# EasyEDA Pro project CALU_BMS_V1.3.0.0.epro, board PCB5
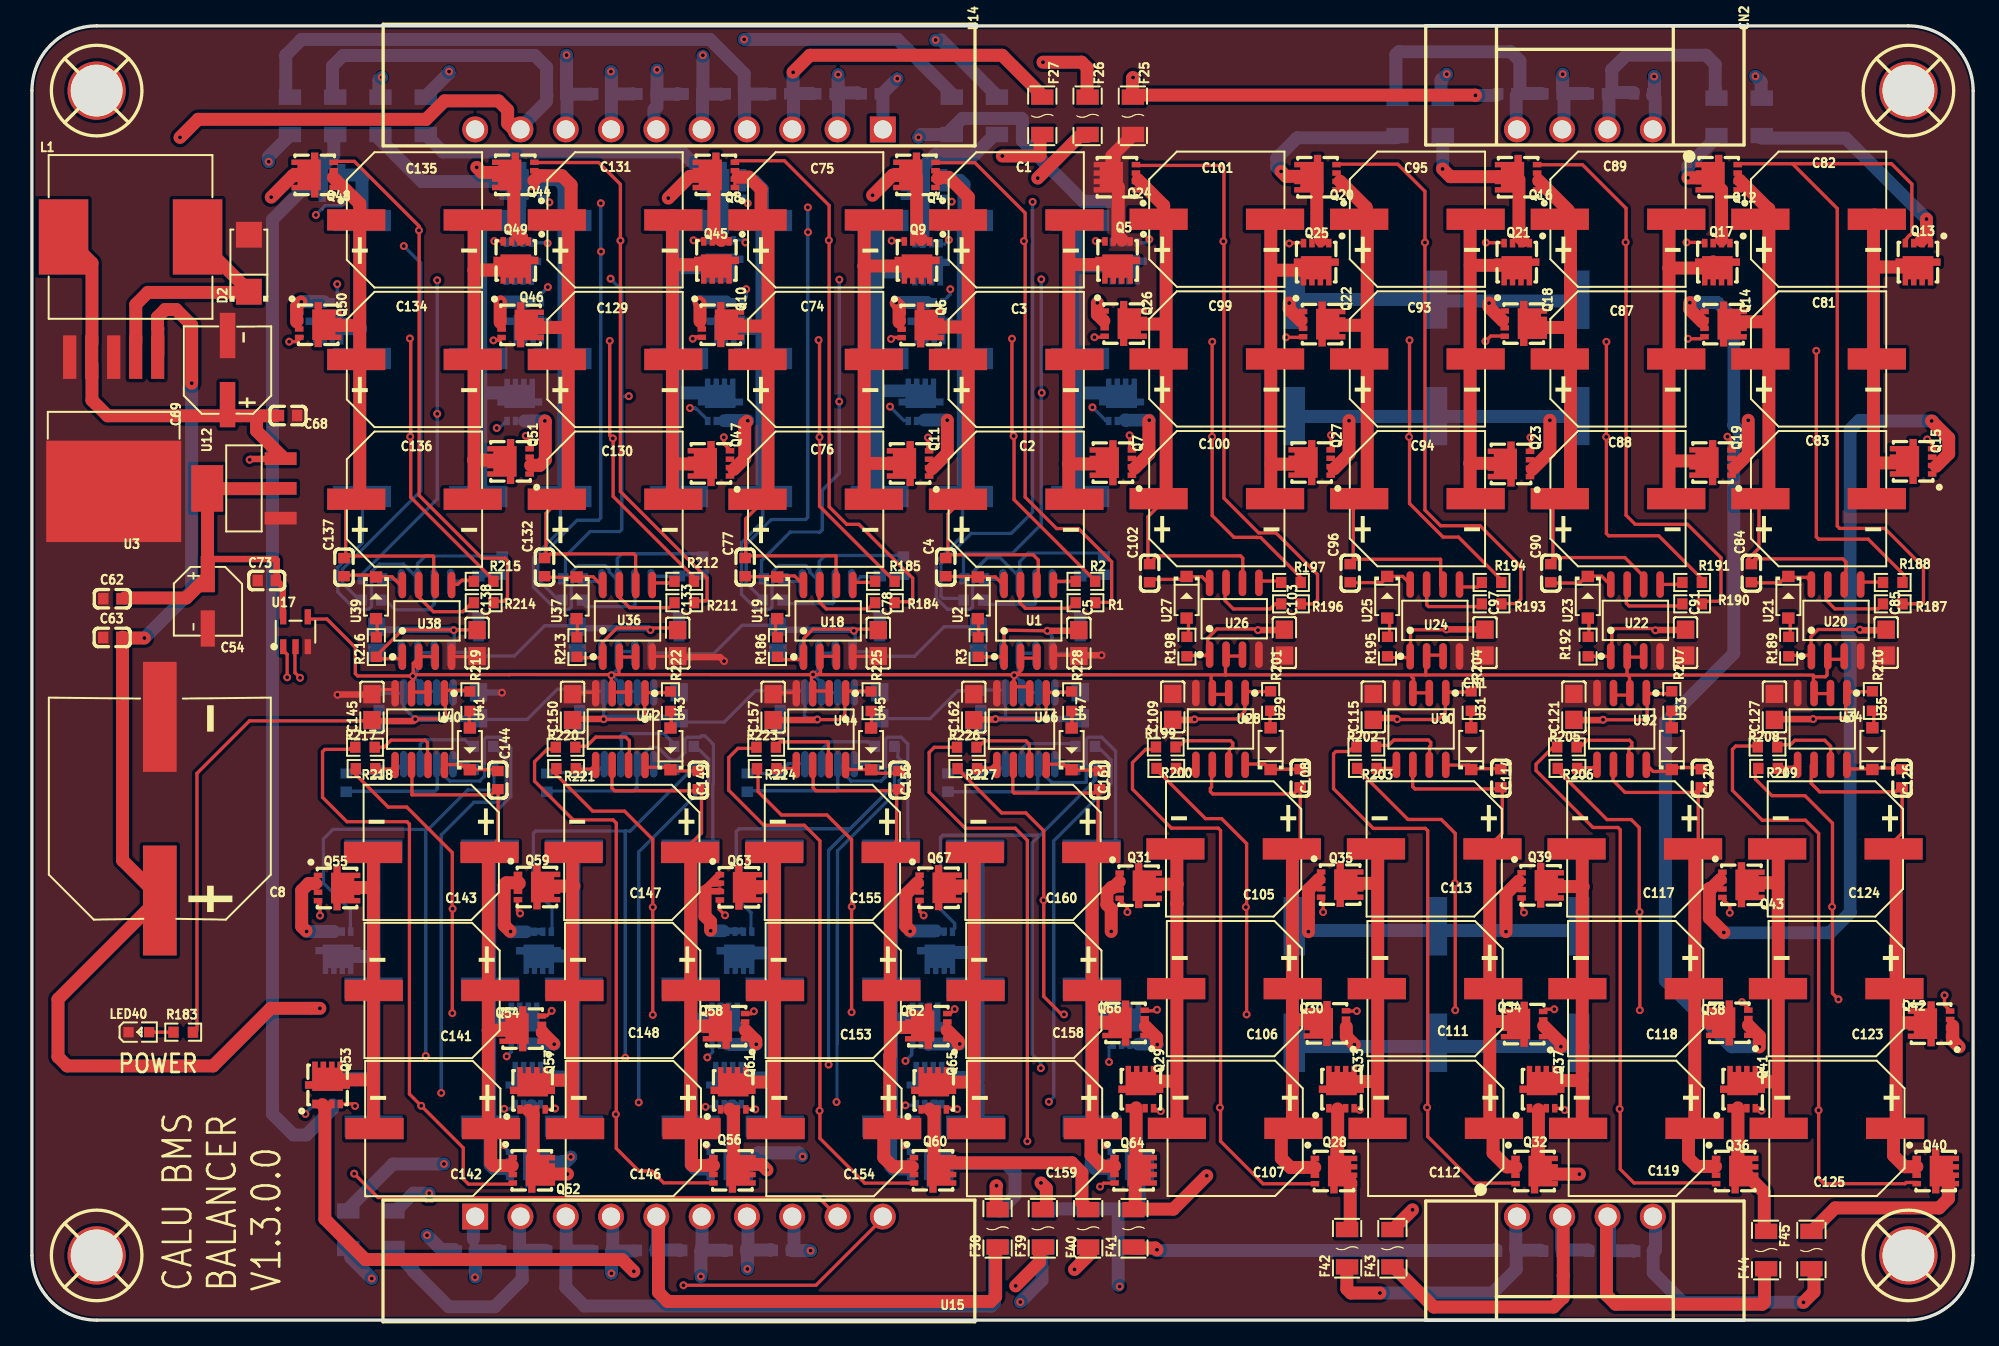
[diagram p21: board, top side]
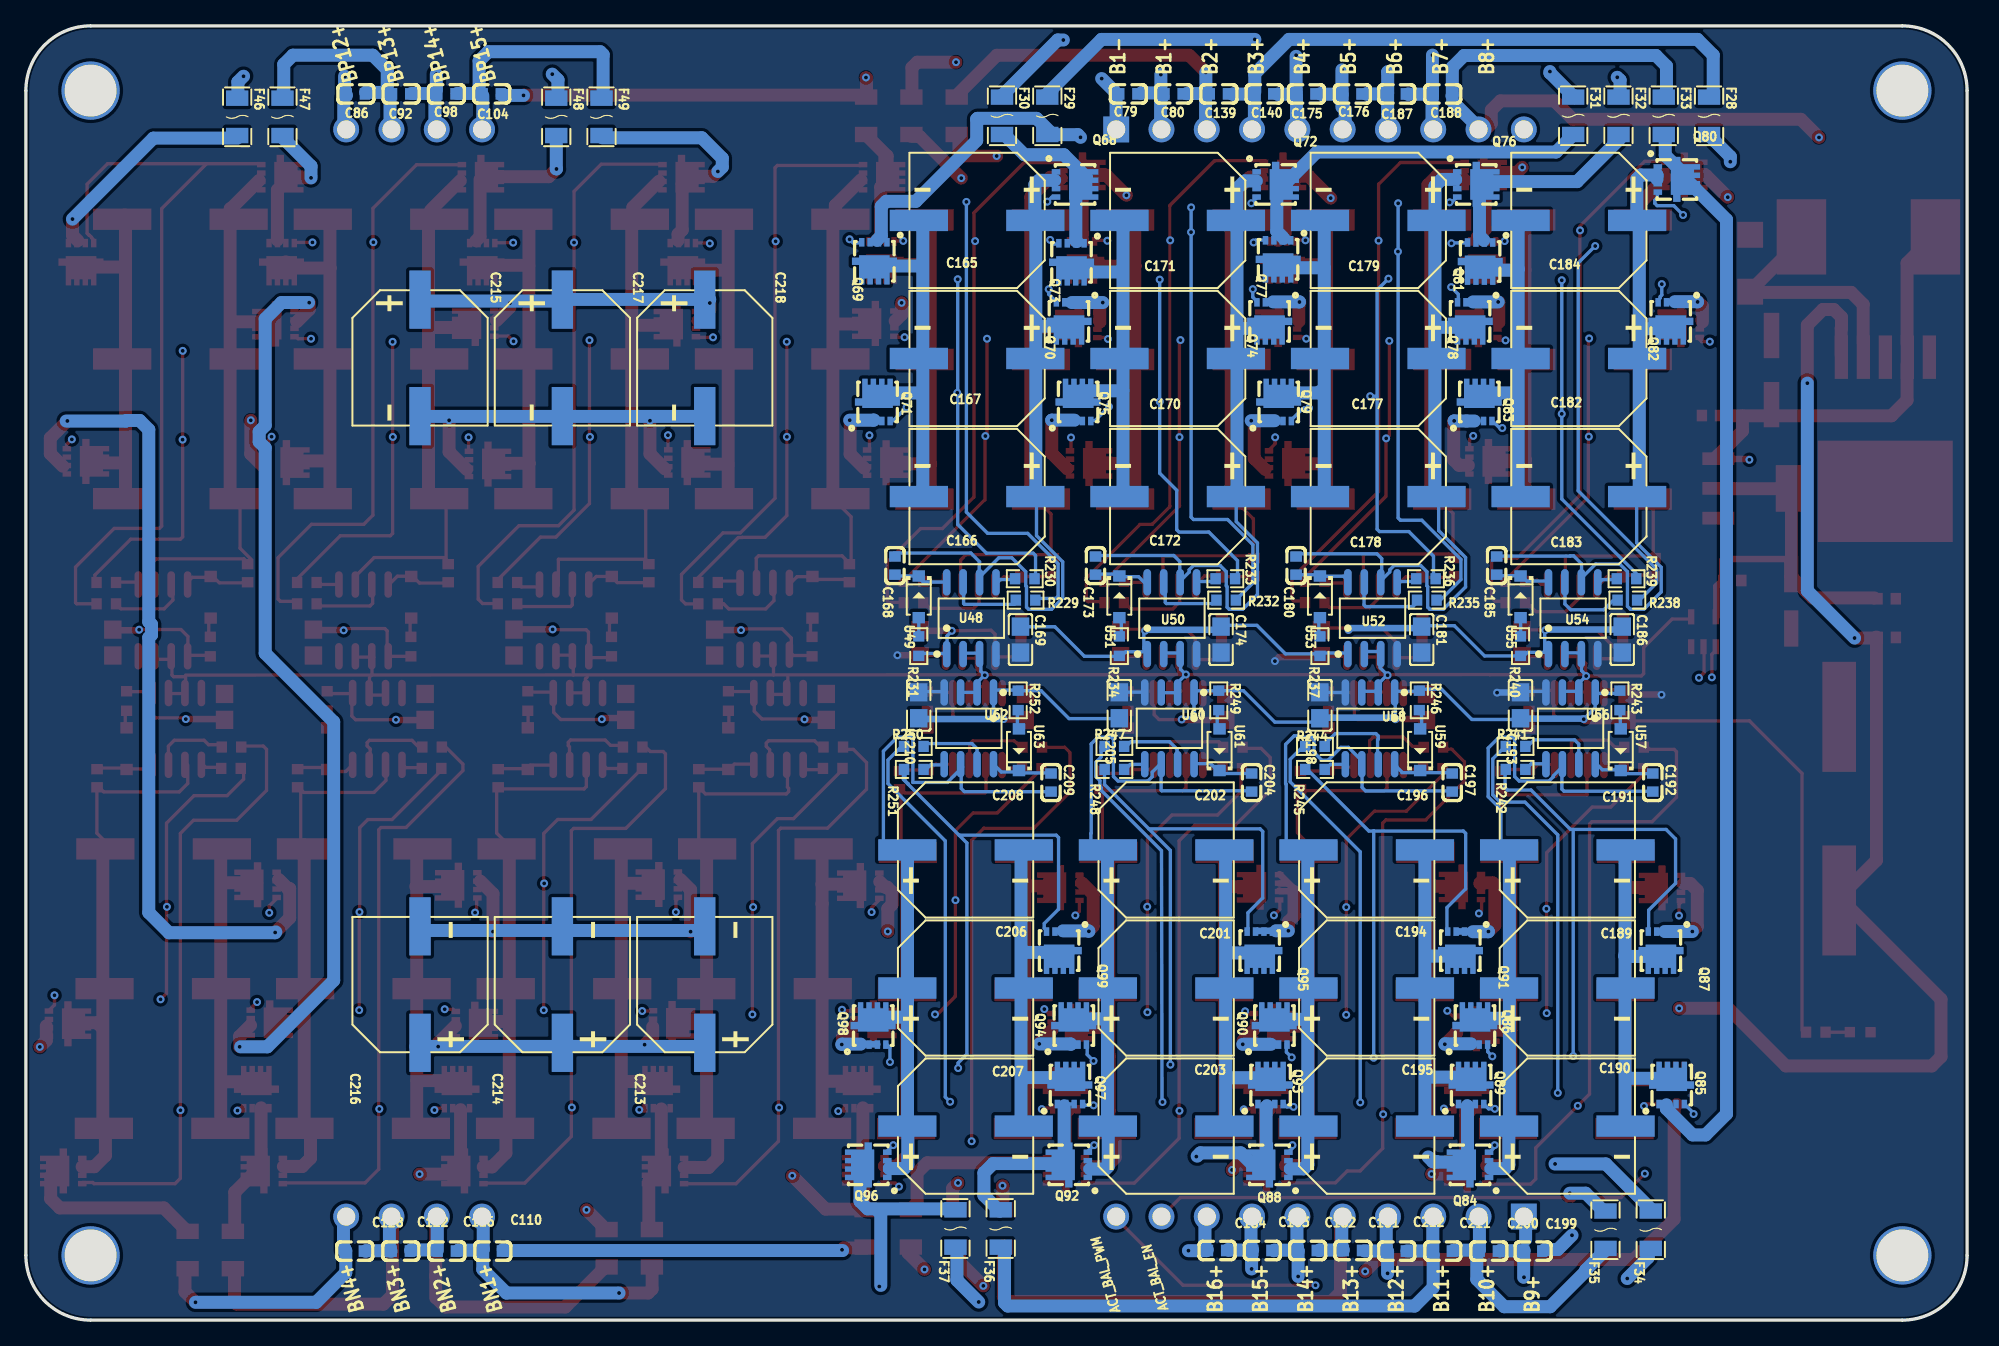
[diagram p22: board, bottom side, seen from below]

Outline 150 x 100 mm; copper layers: Top Layer, Inner1, Inner2, Bottom Layer. Coordinates in mm from the lower left corner of the outline.
Outline path: 0,95 0,5 arc(1.46,1.46) 5,0 145,0 arc(148.54,1.46) 150,5 150,95 arc(148.54,98.54) 145,100 5,100 arc(1.46,98.54) 0,95
Stack: Top Layer 0.035mm Outer layer thickness 1oz / Dielectric1 0.2104mm 7628 RC49% 8.6mil / Inner1 0.0152mm Inner layer thickness / Dielectric2 1.065mm 1.1mm H/HOZ Copper / Inner2 0.0152mm Inner layer thickness / Dielectric3 0.2104mm 7628 RC49% 8.6mil / Bottom Layer 0.035mm Outer layer thickness 1oz

## Design rules (mm)
template: Custom Config
spacing copperThickness1oz (default): track to track 0.102, other pairs 0.152 to 0.3
spacing copperThickness2oz: track to track 0.203, other pairs 0.152 to 0.3
track width copperThickness1oz (default): min 0.127, default 0.254, max 2.54
track width copperThickness2oz: min 0.203, default 0.254, max 2.54
differential pair differentialPair (default): width min 0.127, default 0.254, max 2.54; gap min 0.152, default 0.152
via viaSize (default): diameter min 0.5, default 0.61, max 10; hole min 0.3, default 0.305, max 6.3

## Placement (name value [footprint] x y rotation side)
C1  2200uF  [CAP-SMD_BD10.0-L10.3-W10.3-LS11.0-FD]  76.06 85.01 0 top
C2  2200uF  [CAP-SMD_BD10.0-L10.3-W10.3-LS11.0-FD]  76.06 63.43 0 top
C3  2200uF  [CAP-SMD_BD10.0-L10.3-W10.3-LS11.0-FD]  76.06 74.23 0 top
C4  470nF  [C0603]  70.61 58.18 90 top
C5  10uF  [C0805]  80.9 52.31 270 top
C8  470uF  [CAP-SMD_BD16.0-L17.0-W17.0-FD-LS18.0]  9.88 39.52 90 top
C54  22uF  [CAP-SMD_BD5.0-L5.3-W5.3-LS6.0-FD]  13.59 55.54 270 top
C62  100nF  [C0603]  6.21 55.74 0 top
C63  100nF  [C0603]  6.2 52.75 0 top
C68  100nF  [C0603]  19.79 69.89 180 top
C69  470uF  [CAP-SMD_BD6.3-L6.6-W6.6-LS7.6-RD]  15.11 73.41 90 top
C73  100nF  [C0603]  18.14 57.15 0 top
C74  2200uF  [CAP-SMD_BD10.0-L10.3-W10.3-LS11.0-FD]  60.56 74.23 0 top
C75  2200uF  [CAP-SMD_BD10.0-L10.3-W10.3-LS11.0-FD]  60.56 85.01 0 top
C76  2200uF  [CAP-SMD_BD10.0-L10.3-W10.3-LS11.0-FD]  60.56 63.43 0 top
C77  470nF  [C0603]  55.11 58.18 90 top
C78  10uF  [C0805]  65.4 52.31 270 top
C79  100nF  [C0603]  64.81 94.75 180 bottom
C80  100nF  [C0603]  61.31 94.75 180 bottom
C81  2200uF  [CAP-SMD_BD10.0-L10.3-W10.3-LS11.0-FD]  138.06 74.27 0 top
C82  2200uF  [CAP-SMD_BD10.0-L10.3-W10.3-LS11.0-FD]  138.06 85.06 0 top
C83  2200uF  [CAP-SMD_BD10.0-L10.3-W10.3-LS11.0-FD]  138.06 63.47 0 top
C84  470nF  [C0603]  132.87 57.71 90 top
C85  10uF  [C0805]  143.28 52.35 270 top
C86  100nF  [C0603]  124.5 94.75 180 bottom
C87  2200uF  [CAP-SMD_BD10.0-L10.3-W10.3-LS11.0-FD]  122.56 74.27 0 top
C88  2200uF  [CAP-SMD_BD10.0-L10.3-W10.3-LS11.0-FD]  122.56 63.47 0 top
C89  2200uF  [CAP-SMD_BD10.0-L10.3-W10.3-LS11.0-FD]  122.56 85.06 0 top
C90  470nF  [C0603]  117.37 57.71 90 top
C91  10uF  [C0805]  127.78 52.35 270 top
C92  100nF  [C0603]  121 94.75 180 bottom
C93  2200uF  [CAP-SMD_BD10.0-L10.3-W10.3-LS11.0-FD]  107.06 74.27 0 top
C94  2200uF  [CAP-SMD_BD10.0-L10.3-W10.3-LS11.0-FD]  107.06 63.47 0 top
C95  2200uF  [CAP-SMD_BD10.0-L10.3-W10.3-LS11.0-FD]  107.06 85.06 0 top
C96  470nF  [C0603]  101.87 57.71 90 top
C97  10uF  [C0805]  112.28 52.35 270 top
C98  100nF  [C0603]  117.5 94.75 180 bottom
C99  2200uF  [CAP-SMD_BD10.0-L10.3-W10.3-LS11.0-FD]  91.56 74.27 0 top
C100  2200uF  [CAP-SMD_BD10.0-L10.3-W10.3-LS11.0-FD]  91.56 63.47 0 top
C101  2200uF  [CAP-SMD_BD10.0-L10.3-W10.3-LS11.0-FD]  91.56 85.06 0 top
C102  470nF  [C0603]  86.37 57.71 90 top
C103  10uF  [C0805]  96.78 52.35 270 top
C104  100nF  [C0603]  114 94.75 180 bottom
C105  2200uF  [CAP-SMD_BD10.0-L10.3-W10.3-LS11.0-FD]  92.86 36.41 180 top
C106  2200uF  [CAP-SMD_BD10.0-L10.3-W10.3-LS11.0-FD]  92.92 25.61 180 top
C107  2200uF  [CAP-SMD_BD10.0-L10.3-W10.3-LS11.0-FD]  92.97 14.82 180 top
C108  470nF  [C0603]  98 41.87 270 top
C109  10uF  [C0805]  88.15 47.38 90 top
C110  100nF  [C0603]  113.92 5.33 0 bottom
C111  2200uF  [CAP-SMD_BD10.0-L10.3-W10.3-LS11.0-FD]  108.42 25.61 180 top
C112  2200uF  [CAP-SMD_BD10.0-L10.3-W10.3-LS11.0-FD]  108.47 14.82 180 top
C113  2200uF  [CAP-SMD_BD10.0-L10.3-W10.3-LS11.0-FD]  108.36 36.41 180 top
C114  470nF  [C0603]  113.5 41.87 270 top
C115  10uF  [C0805]  103.65 47.38 90 top
C116  100nF  [C0603]  117.47 5.33 0 bottom
C117  2200uF  [CAP-SMD_BD10.0-L10.3-W10.3-LS11.0-FD]  123.86 36.41 180 top
C118  2200uF  [CAP-SMD_BD10.0-L10.3-W10.3-LS11.0-FD]  123.92 25.61 180 top
C119  2200uF  [CAP-SMD_BD10.0-L10.3-W10.3-LS11.0-FD]  123.97 14.82 180 top
C120  470nF  [C0603]  129 41.87 270 top
C121  10uF  [C0805]  119.15 47.38 90 top
C122  100nF  [C0603]  121.03 5.33 0 bottom
C123  2200uF  [CAP-SMD_BD10.0-L10.3-W10.3-LS11.0-FD]  139.42 25.61 180 top
C124  2200uF  [CAP-SMD_BD10.0-L10.3-W10.3-LS11.0-FD]  139.36 36.41 180 top
C125  2200uF  [CAP-SMD_BD10.0-L10.3-W10.3-LS11.0-FD]  139.47 14.82 180 top
C126  470nF  [C0603]  144.5 41.87 270 top
C127  10uF  [C0805]  134.65 47.38 90 top
C128  100nF  [C0603]  124.59 5.33 0 bottom
C129  2200uF  [CAP-SMD_BD10.0-L10.3-W10.3-LS11.0-FD]  45.06 74.23 0 top
C130  2200uF  [CAP-SMD_BD10.0-L10.3-W10.3-LS11.0-FD]  45.06 63.43 0 top
C131  2200uF  [CAP-SMD_BD10.0-L10.3-W10.3-LS11.0-FD]  45.06 85.01 0 top
C132  470nF  [C0603]  39.61 58.18 90 top
C133  10uF  [C0805]  49.9 52.31 270 top
C134  2200uF  [CAP-SMD_BD10.0-L10.3-W10.3-LS11.0-FD]  29.56 74.23 0 top
C135  2200uF  [CAP-SMD_BD10.0-L10.3-W10.3-LS11.0-FD]  29.56 85.01 0 top
C136  2200uF  [CAP-SMD_BD10.0-L10.3-W10.3-LS11.0-FD]  29.56 63.43 0 top
C137  470nF  [C0603]  24.11 58.18 90 top
C138  10uF  [C0805]  34.4 52.31 270 top
C139  100nF  [C0603]  57.81 94.75 180 bottom
C140  100nF  [C0603]  54.31 94.75 180 bottom
C141  2200uF  [CAP-SMD_BD10.0-L10.3-W10.3-LS11.0-FD]  30.92 25.47 180 top
C142  2200uF  [CAP-SMD_BD10.0-L10.3-W10.3-LS11.0-FD]  30.97 14.8 180 top
C143  2200uF  [CAP-SMD_BD10.0-L10.3-W10.3-LS11.0-FD]  30.86 36.14 180 top
C144  470nF  [C0603]  36 41.72 270 top
C145  10uF  [C0805]  26.27 47.36 90 top
C146  2200uF  [CAP-SMD_BD10.0-L10.3-W10.3-LS11.0-FD]  46.47 14.8 180 top
C147  2200uF  [CAP-SMD_BD10.0-L10.3-W10.3-LS11.0-FD]  46.36 36.14 180 top
C148  2200uF  [CAP-SMD_BD10.0-L10.3-W10.3-LS11.0-FD]  46.42 25.47 180 top
C149  470nF  [C0603]  51.5 41.72 270 top
C150  10uF  [C0805]  41.77 47.36 90 top
C151  100nF  [C0603]  47.45 5.38 0 bottom
C152  100nF  [C0603]  50.95 5.38 0 bottom
C153  2200uF  [CAP-SMD_BD10.0-L10.3-W10.3-LS11.0-FD]  61.92 25.47 180 top
C154  2200uF  [CAP-SMD_BD10.0-L10.3-W10.3-LS11.0-FD]  61.97 14.8 180 top
C155  2200uF  [CAP-SMD_BD10.0-L10.3-W10.3-LS11.0-FD]  61.86 36.14 180 top
C156  470nF  [C0603]  67 41.72 270 top
C157  10uF  [C0805]  57.27 47.36 90 top
C158  2200uF  [CAP-SMD_BD10.0-L10.3-W10.3-LS11.0-FD]  77.42 25.47 180 top
C159  2200uF  [CAP-SMD_BD10.0-L10.3-W10.3-LS11.0-FD]  77.47 14.8 180 top
C160  2200uF  [CAP-SMD_BD10.0-L10.3-W10.3-LS11.0-FD]  77.36 36.14 180 top
C161  470nF  [C0603]  82.5 41.72 270 top
C162  10uF  [C0805]  72.77 47.36 90 top
C163  100nF  [C0603]  54.45 5.38 0 bottom
C164  100nF  [C0603]  57.95 5.38 0 bottom
C165  2200uF  [CAP-SMD_BD10.0-L10.3-W10.3-LS11.0-FD]  76.5 84.97 0 bottom
C166  2200uF  [CAP-SMD_BD10.0-L10.3-W10.3-LS11.0-FD]  76.5 63.63 0 bottom
C167  2200uF  [CAP-SMD_BD10.0-L10.3-W10.3-LS11.0-FD]  76.5 74.3 0 bottom
C168  470nF  [C0603]  82.85 58.3 90 bottom
C169  10uF  [C0805]  73.15 52.58 270 bottom
C170  2200uF  [CAP-SMD_BD10.0-L10.3-W10.3-LS11.0-FD]  61 74.3 0 bottom
C171  2200uF  [CAP-SMD_BD10.0-L10.3-W10.3-LS11.0-FD]  61 84.97 0 bottom
C172  2200uF  [CAP-SMD_BD10.0-L10.3-W10.3-LS11.0-FD]  61 63.63 0 bottom
C173  470nF  [C0603]  67.35 58.3 90 bottom
C174  10uF  [C0805]  57.64 52.58 270 bottom
C175  100nF  [C0603]  51.05 94.74 180 bottom
C176  100nF  [C0603]  47.5 94.74 180 bottom
C177  2200uF  [CAP-SMD_BD10.0-L10.3-W10.3-LS11.0-FD]  45.5 74.3 0 bottom
C178  2200uF  [CAP-SMD_BD10.0-L10.3-W10.3-LS11.0-FD]  45.5 63.63 0 bottom
C179  2200uF  [CAP-SMD_BD10.0-L10.3-W10.3-LS11.0-FD]  45.5 84.97 0 bottom
C180  470nF  [C0603]  51.85 58.3 90 bottom
C181  10uF  [C0805]  42.14 52.58 270 bottom
C182  2200uF  [CAP-SMD_BD10.0-L10.3-W10.3-LS11.0-FD]  30 74.3 0 bottom
C183  2200uF  [CAP-SMD_BD10.0-L10.3-W10.3-LS11.0-FD]  30 63.63 0 bottom
C184  2200uF  [CAP-SMD_BD10.0-L10.3-W10.3-LS11.0-FD]  30 84.97 0 bottom
C185  470nF  [C0603]  36.35 58.3 90 bottom
C186  10uF  [C0805]  26.64 52.58 270 bottom
C187  100nF  [C0603]  44.07 94.74 180 bottom
C188  100nF  [C0603]  40.51 94.74 180 bottom
C189  2200uF  [CAP-SMD_BD10.0-L10.3-W10.3-LS11.0-FD]  30.89 25.66 180 bottom
C190  2200uF  [CAP-SMD_BD10.0-L10.3-W10.3-LS11.0-FD]  30.89 14.99 180 bottom
C191  2200uF  [CAP-SMD_BD10.0-L10.3-W10.3-LS11.0-FD]  30.89 36.33 180 bottom
C192  470nF  [C0603]  24.28 41.53 270 bottom
C193  10uF  [C0805]  34.51 47.5 90 bottom
C194  2200uF  [CAP-SMD_BD10.0-L10.3-W10.3-LS11.0-FD]  46.39 25.66 180 bottom
C195  2200uF  [CAP-SMD_BD10.0-L10.3-W10.3-LS11.0-FD]  46.39 14.99 180 bottom
C196  2200uF  [CAP-SMD_BD10.0-L10.3-W10.3-LS11.0-FD]  46.39 36.33 180 bottom
C197  470nF  [C0603]  39.78 41.53 270 bottom
C198  10uF  [C0805]  50.01 47.5 90 bottom
C199  100nF  [C0603]  33.53 5.33 0 bottom
C200  100nF  [C0603]  36.96 5.33 0 bottom
C201  2200uF  [CAP-SMD_BD10.0-L10.3-W10.3-LS11.0-FD]  61.89 25.66 180 bottom
C202  2200uF  [CAP-SMD_BD10.0-L10.3-W10.3-LS11.0-FD]  61.89 36.33 180 bottom
C203  2200uF  [CAP-SMD_BD10.0-L10.3-W10.3-LS11.0-FD]  61.89 14.99 180 bottom
C204  470nF  [C0603]  55.28 41.53 270 bottom
C205  10uF  [C0805]  65.51 47.5 90 bottom
C206  2200uF  [CAP-SMD_BD10.0-L10.3-W10.3-LS11.0-FD]  77.39 25.66 180 bottom
C207  2200uF  [CAP-SMD_BD10.0-L10.3-W10.3-LS11.0-FD]  77.39 14.99 180 bottom
C208  2200uF  [CAP-SMD_BD10.0-L10.3-W10.3-LS11.0-FD]  77.39 36.33 180 bottom
C209  470nF  [C0603]  70.78 41.53 270 bottom
C210  10uF  [C0805]  81.01 47.5 90 bottom
C211  100nF  [C0603]  40.51 5.33 0 bottom
C212  100nF  [C0603]  44.07 5.33 0 bottom
C213  2200uF  [CAP-SMD_BD10.0-L10.3-W10.3-LS11.0-FD]  97.54 25.93 90 bottom
C214  2200uF  [CAP-SMD_BD10.0-L10.3-W10.3-LS11.0-FD]  108.54 25.93 90 bottom
C215  2200uF  [CAP-SMD_BD10.0-L10.3-W10.3-LS11.0-FD]  119.54 74.35 270 bottom
C216  2200uF  [CAP-SMD_BD10.0-L10.3-W10.3-LS11.0-FD]  119.54 25.93 90 bottom
C217  2200uF  [CAP-SMD_BD10.0-L10.3-W10.3-LS11.0-FD]  108.54 74.35 270 bottom
C218  2200uF  [CAP-SMD_BD10.0-L10.3-W10.3-LS11.0-FD]  97.54 74.35 270 bottom
CN1  BATT_NEXT  [CONN-TH_4P-P3.50_MAX_MX15EDGRM-3.5-04P-GN01-CU-A]  120 8 0 top
CN2  BATT_PREV  [CONN-TH_4P-P3.50_MAX_MX15EDGRM-3.5-04P-GN01-CU-A]  120 92 180 top
D2  SS34  [SMA_L4.3-W2.6-LS5.2-RD]  16.76 81.66 90 top
F25  SMD1206P005TF  [F1206]  85.07 93.05 270 top
F26  SMD1206P005TF  [F1206]  81.57 93.05 270 top
F27  SMD1206P005TF  [F1206]  78.07 93.05 270 top
F28  SMD1206P005TF  [F1206]  19.94 93.05 270 bottom
F29  SMD1206P005TF  [F1206]  71.07 93.05 270 bottom
F30  SMD1206P005TF  [F1206]  74.57 93.05 270 bottom
F31  SMD1206P005TF  [F1206]  30.44 93.05 270 bottom
F32  SMD1206P005TF  [F1206]  26.94 93.05 270 bottom
F33  SMD1206P005TF  [F1206]  23.44 93.05 270 bottom
F34  SMD1206P005TF  [F1206]  24.44 6.99 90 bottom
F35  SMD1206P005TF  [F1206]  27.94 6.99 90 bottom
F36  SMD1206P005TF  [F1206]  74.67 7.08 90 bottom
F37  SMD1206P005TF  [F1206]  78.17 7.08 90 bottom
F38  SMD1206P005TF  [F1206]  74.62 7.09 90 top
F39  SMD1206P005TF  [F1206]  78.12 7.09 90 top
F40  SMD1206P005TF  [F1206]  81.62 7.09 90 top
F41  SMD1206P005TF  [F1206]  85.12 7.09 90 top
F42  SMD1206P005TF  [F1206]  101.63 5.55 90 top
F43  SMD1206P005TF  [F1206]  105.13 5.55 90 top
F44  SMD1206P005TF  [F1206]  134 5.41 90 top
F45  SMD1206P005TF  [F1206]  137.5 5.41 90 top
F46  SMD1206P005TF  [F1206]  133.67 92.97 270 bottom
F47  SMD1206P005TF  [F1206]  130.17 92.97 270 bottom
F48  SMD1206P005TF  [F1206]  109.02 92.97 270 bottom
F49  SMD1206P005TF  [F1206]  105.52 92.97 270 bottom
L1  68uH  [IND-SMD_L12.5-W12.5]  7.62 83.69 0 top
LED40  LED_PWR  [LED0603-RD-YELLOW]  8.26 22.25 0 top
Q4  40N06D  [WDFN-5_L3.1-W3.1-P0.65-BL_1]  69.08 88.49 90 top
Q5  40N06D  [WDFN-5_L3.1-W3.1-P0.65-BL_1]  83.89 82.61 180 top
Q6  40N06D  [WDFN-5_L3.1-W3.1-P0.65-BL_1]  67.94 76.89 270 top
Q7  40N06D  [WDFN-5_L3.1-W3.1-P0.65-BL_1]  84.26 66.25 90 top
Q8  40N06D  [WDFN-5_L3.1-W3.1-P0.65-BL_1]  53.58 88.49 90 top
Q9  40N06D  [WDFN-5_L3.1-W3.1-P0.65-BL_1]  68.39 82.61 180 top
Q10  40N06D  [WDFN-5_L3.1-W3.1-P0.65-BL_1]  52.5 76.91 270 top
Q11  40N06D  [WDFN-5_L3.1-W3.1-P0.65-BL_1]  68.59 66.19 90 top
Q12  40N06D  [WDFN-5_L3.1-W3.1-P0.65-BL_1]  131.08 88.3 90 top
Q13  40N06D  [WDFN-5_L3.1-W3.1-P0.65-BL_1]  145.74 82.48 180 top
Q14  40N06D  [WDFN-5_L3.1-W3.1-P0.65-BL_1]  129.98 76.95 270 top
Q15  40N06D  [WDFN-5_L3.1-W3.1-P0.65-BL_1]  146.1 66.36 90 top
Q16  40N06D  [WDFN-5_L3.1-W3.1-P0.65-BL_1]  115.58 88.3 90 top
Q17  40N06D  [WDFN-5_L3.1-W3.1-P0.65-BL_1]  130.24 82.48 180 top
Q18  40N06D  [WDFN-5_L3.1-W3.1-P0.65-BL_1]  114.54 77 270 top
Q19  40N06D  [WDFN-5_L3.1-W3.1-P0.65-BL_1]  130.6 66.26 90 top
Q20  40N06D  [WDFN-5_L3.1-W3.1-P0.65-BL_1]  100.08 88.3 90 top
Q21  40N06D  [WDFN-5_L3.1-W3.1-P0.65-BL_1]  114.74 82.48 180 top
Q22  40N06D  [WDFN-5_L3.1-W3.1-P0.65-BL_1]  98.96 76.95 270 top
Q23  40N06D  [WDFN-5_L3.1-W3.1-P0.65-BL_1]  115.03 66.15 90 top
Q24  40N06D  [WDFN-5_L3.1-W3.1-P0.65-BL_1]  84.58 88.3 90 top
Q25  40N06D  [WDFN-5_L3.1-W3.1-P0.65-BL_1]  99.24 82.48 180 top
Q26  40N06D  [WDFN-5_L3.1-W3.1-P0.65-BL_1]  83.62 77 270 top
Q27  40N06D  [WDFN-5_L3.1-W3.1-P0.65-BL_1]  99.62 66.27 90 top
Q28  40N06D  [WDFN-5_L3.1-W3.1-P0.65-BL_1]  99.88 11.52 270 top
Q29  40N06D  [WDFN-5_L3.1-W3.1-P0.65-BL_1]  85.69 17.11 0 top
Q30  40N06D  [WDFN-5_L3.1-W3.1-P0.65-BL_1]  100.81 22.93 90 top
Q31  40N06D  [WDFN-5_L3.1-W3.1-P0.65-BL_1]  84.79 33.56 270 top
Q32  40N06D  [WDFN-5_L3.1-W3.1-P0.65-BL_1]  115.38 11.52 270 top
Q33  40N06D  [WDFN-5_L3.1-W3.1-P0.65-BL_1]  101.19 17.11 0 top
Q34  40N06D  [WDFN-5_L3.1-W3.1-P0.65-BL_1]  116.04 22.87 90 top
Q35  40N06D  [WDFN-5_L3.1-W3.1-P0.65-BL_1]  100.36 33.65 270 top
Q36  40N06D  [WDFN-5_L3.1-W3.1-P0.65-BL_1]  130.88 11.52 270 top
Q37  40N06D  [WDFN-5_L3.1-W3.1-P0.65-BL_1]  116.69 17.11 0 top
Q38  40N06D  [WDFN-5_L3.1-W3.1-P0.65-BL_1]  131.89 22.98 90 top
Q39  40N06D  [WDFN-5_L3.1-W3.1-P0.65-BL_1]  115.85 33.59 270 top
Q40  40N06D  [WDFN-5_L3.1-W3.1-P0.65-BL_1]  146.38 11.52 270 top
Q41  40N06D  [WDFN-5_L3.1-W3.1-P0.65-BL_1]  132.19 17.11 0 top
Q42  40N06D  [WDFN-5_L3.1-W3.1-P0.65-BL_1]  147.49 22.91 90 top
Q43  40N06D  [WDFN-5_L3.1-W3.1-P0.65-BL_1]  131.36 33.63 270 top
Q44  40N06D  [WDFN-5_L3.1-W3.1-P0.65-BL_1]  38.08 88.49 90 top
Q45  40N06D  [WDFN-5_L3.1-W3.1-P0.65-BL_1]  52.89 82.61 180 top
Q46  40N06D  [WDFN-5_L3.1-W3.1-P0.65-BL_1]  37.03 76.9 270 top
Q47  40N06D  [WDFN-5_L3.1-W3.1-P0.65-BL_1]  53.21 66.2 90 top
Q48  40N06D  [WDFN-5_L3.1-W3.1-P0.65-BL_1]  22.58 88.49 90 top
Q49  40N06D  [WDFN-5_L3.1-W3.1-P0.65-BL_1]  37.39 82.61 180 top
Q50  40N06D  [WDFN-5_L3.1-W3.1-P0.65-BL_1]  21.39 76.91 270 top
Q51  40N06D  [WDFN-5_L3.1-W3.1-P0.65-BL_1]  37.72 66.35 90 top
Q52  40N06D  [WDFN-5_L3.1-W3.1-P0.65-BL_1]  37.89 11.57 270 top
Q53  40N06D  [WDFN-5_L3.1-W3.1-P0.65-BL_1]  22.85 17.44 0 top
Q54  40N06D  [WDFN-5_L3.1-W3.1-P0.65-BL_1]  38.65 22.52 90 top
Q55  40N06D  [WDFN-5_L3.1-W3.1-P0.65-BL_1]  22.84 33.39 270 top
Q56  40N06D  [WDFN-5_L3.1-W3.1-P0.65-BL_1]  53.39 11.57 270 top
Q57  40N06D  [WDFN-5_L3.1-W3.1-P0.65-BL_1]  38.69 17.02 0 top
Q58  40N06D  [WDFN-5_L3.1-W3.1-P0.65-BL_1]  54.37 22.71 90 top
Q59  40N06D  [WDFN-5_L3.1-W3.1-P0.65-BL_1]  38.29 33.46 270 top
Q60  40N06D  [WDFN-5_L3.1-W3.1-P0.65-BL_1]  68.89 11.57 270 top
Q61  40N06D  [WDFN-5_L3.1-W3.1-P0.65-BL_1]  54.19 17.02 0 top
Q62  40N06D  [WDFN-5_L3.1-W3.1-P0.65-BL_1]  70 22.71 90 top
Q63  40N06D  [WDFN-5_L3.1-W3.1-P0.65-BL_1]  53.89 33.44 270 top
Q64  40N06D  [WDFN-5_L3.1-W3.1-P0.65-BL_1]  84.39 11.57 270 top
Q65  40N06D  [WDFN-5_L3.1-W3.1-P0.65-BL_1]  69.69 17.02 0 top
Q66  40N06D  [WDFN-5_L3.1-W3.1-P0.65-BL_1]  85.24 22.97 90 top
Q67  40N06D  [WDFN-5_L3.1-W3.1-P0.65-BL_1]  69.32 33.4 270 top
Q68  40N06D  [WDFN-5_L3.1-W3.1-P0.65-BL_1]  69.66 87.75 270 bottom
Q69  40N06D  [WDFN-5_L3.1-W3.1-P0.65-BL_1]  84.44 82.55 0 bottom
Q70  40N06D  [WDFN-5_L3.1-W3.1-P0.65-BL_1]  69.4 77.9 0 bottom
Q71  40N06D  [WDFN-5_L3.1-W3.1-P0.65-BL_1]  84.19 70.21 180 bottom
Q72  40N06D  [WDFN-5_L3.1-W3.1-P0.65-BL_1]  54.16 87.75 270 bottom
Q73  40N06D  [WDFN-5_L3.1-W3.1-P0.65-BL_1]  69.2 82.47 0 bottom
Q74  40N06D  [WDFN-5_L3.1-W3.1-P0.65-BL_1]  53.9 77.9 0 bottom
Q75  40N06D  [WDFN-5_L3.1-W3.1-P0.65-BL_1]  68.69 70.21 180 bottom
Q76  40N06D  [WDFN-5_L3.1-W3.1-P0.65-BL_1]  38.66 87.75 270 bottom
Q77  40N06D  [WDFN-5_L3.1-W3.1-P0.65-BL_1]  53.24 82.7 0 bottom
Q78  40N06D  [WDFN-5_L3.1-W3.1-P0.65-BL_1]  38.4 77.9 0 bottom
Q79  40N06D  [WDFN-5_L3.1-W3.1-P0.65-BL_1]  53.19 70.21 180 bottom
Q80  40N06D  [WDFN-5_L3.1-W3.1-P0.65-BL_1]  23.16 88.13 270 bottom
Q81  40N06D  [WDFN-5_L3.1-W3.1-P0.65-BL_1]  37.63 82.53 0 bottom
Q82  40N06D  [WDFN-5_L3.1-W3.1-P0.65-BL_1]  22.9 77.9 0 bottom
Q83  40N06D  [WDFN-5_L3.1-W3.1-P0.65-BL_1]  37.69 70.21 180 bottom
Q84  40N06D  [WDFN-5_L3.1-W3.1-P0.65-BL_1]  37.67 12 90 bottom
Q85  40N06D  [WDFN-5_L3.1-W3.1-P0.65-BL_1]  22.82 17.43 180 bottom
Q86  40N06D  [WDFN-5_L3.1-W3.1-P0.65-BL_1]  38.02 22.02 180 bottom
Q87  40N06D  [WDFN-5_L3.1-W3.1-P0.65-BL_1]  23.66 29.28 0 bottom
Q88  40N06D  [WDFN-5_L3.1-W3.1-P0.65-BL_1]  53.17 12 90 bottom
Q89  40N06D  [WDFN-5_L3.1-W3.1-P0.65-BL_1]  38.32 17.43 180 bottom
Q90  40N06D  [WDFN-5_L3.1-W3.1-P0.65-BL_1]  53.52 22.02 180 bottom
Q91  40N06D  [WDFN-5_L3.1-W3.1-P0.65-BL_1]  39.16 29.28 0 bottom
Q92  40N06D  [WDFN-5_L3.1-W3.1-P0.65-BL_1]  68.67 12 90 bottom
Q93  40N06D  [WDFN-5_L3.1-W3.1-P0.65-BL_1]  53.82 17.43 180 bottom
Q94  40N06D  [WDFN-5_L3.1-W3.1-P0.65-BL_1]  69.02 22.02 180 bottom
Q95  40N06D  [WDFN-5_L3.1-W3.1-P0.65-BL_1]  54.66 29.28 0 bottom
Q96  40N06D  [WDFN-5_L3.1-W3.1-P0.65-BL_1]  84.17 12 90 bottom
Q97  40N06D  [WDFN-5_L3.1-W3.1-P0.65-BL_1]  69.32 17.43 180 bottom
Q98  40N06D  [WDFN-5_L3.1-W3.1-P0.65-BL_1]  84.52 22.02 180 bottom
Q99  40N06D  [WDFN-5_L3.1-W3.1-P0.65-BL_1]  70.16 29.28 0 bottom
R1  4.7Ω  [R0603]  81.41 55.43 0 top
R2  4.7Ω  [R0603]  81.41 57.08 0 top
R3  4.7Ω  [R0603]  73.11 52 90 top
R183  4.7kΩ  [R0603]  11.69 22.25 0 top
R184  4.7Ω  [R0603]  65.91 55.43 0 top
R185  4.7Ω  [R0603]  65.91 57.08 0 top
R186  4.7Ω  [R0603]  57.61 52 90 top
R187  4.7Ω  [R0603]  143.79 55.34 0 top
R188  4.7Ω  [R0603]  143.79 56.99 0 top
R189  4.7Ω  [R0603]  135.75 52.04 90 top
R190  4.7Ω  [R0603]  128.29 55.34 0 top
R191  4.7Ω  [R0603]  128.29 56.99 0 top
R192  4.7Ω  [R0603]  120.25 52.04 90 top
R193  4.7Ω  [R0603]  112.79 55.34 0 top
R194  4.7Ω  [R0603]  112.79 56.99 0 top
R195  4.7Ω  [R0603]  104.75 52.04 90 top
R196  4.7Ω  [R0603]  97.29 55.34 0 top
R197  4.7Ω  [R0603]  97.29 56.99 0 top
R198  4.7Ω  [R0603]  89.25 52.04 90 top
R199  4.7Ω  [R0603]  87.61 44.28 180 top
R200  4.7Ω  [R0603]  87.65 42.63 180 top
R201  4.7Ω  [R0603]  95.72 47.84 270 top
R202  4.7Ω  [R0603]  103.11 44.28 180 top
R203  4.7Ω  [R0603]  103.15 42.63 180 top
R204  4.7Ω  [R0603]  111.22 47.84 270 top
R205  4.7Ω  [R0603]  118.61 44.28 180 top
R206  4.7Ω  [R0603]  118.65 42.63 180 top
R207  4.7Ω  [R0603]  126.72 47.84 270 top
R208  4.7Ω  [R0603]  134.11 44.28 180 top
R209  4.7Ω  [R0603]  134.15 42.63 180 top
R210  4.7Ω  [R0603]  142.22 47.84 270 top
R211  4.7Ω  [R0603]  50.41 55.43 0 top
R212  4.7Ω  [R0603]  50.41 57.08 0 top
R213  4.7Ω  [R0603]  42.11 52 90 top
R214  4.7Ω  [R0603]  34.91 55.43 0 top
R215  4.7Ω  [R0603]  34.91 57.08 0 top
R216  4.7Ω  [R0603]  26.61 52 90 top
R217  4.7Ω  [R0603]  25.74 44.27 180 top
R218  4.7Ω  [R0603]  25.78 42.61 180 top
R219  4.7Ω  [R0603]  33.84 47.82 270 top
R220  4.7Ω  [R0603]  41.24 44.27 180 top
R221  4.7Ω  [R0603]  41.28 42.61 180 top
R222  4.7Ω  [R0603]  49.34 47.82 270 top
R223  4.7Ω  [R0603]  56.74 44.27 180 top
R224  4.7Ω  [R0603]  56.78 42.61 180 top
R225  4.7Ω  [R0603]  64.84 47.82 270 top
R226  4.7Ω  [R0603]  72.24 44.27 180 top
R227  4.7Ω  [R0603]  72.28 42.61 180 top
R228  4.7Ω  [R0603]  80.34 47.82 270 top
R229  4.7Ω  [R0603]  72.75 55.63 180 bottom
R230  4.7Ω  [R0603]  72.81 57.28 180 bottom
R231  4.7Ω  [R0603]  81.01 52.08 90 bottom
R232  4.7Ω  [R0603]  57.25 55.63 180 bottom
R233  4.7Ω  [R0603]  57.31 57.28 180 bottom
R234  4.7Ω  [R0603]  65.51 52.08 90 bottom
R235  4.7Ω  [R0603]  41.75 55.63 180 bottom
R236  4.7Ω  [R0603]  41.81 57.28 180 bottom
R237  4.7Ω  [R0603]  50.01 52.08 90 bottom
R238  4.7Ω  [R0603]  26.25 55.63 180 bottom
R239  4.7Ω  [R0603]  26.31 57.28 180 bottom
R240  4.7Ω  [R0603]  34.51 52.08 90 bottom
R241  4.7Ω  [R0603]  34.89 44.33 0 bottom
R242  4.7Ω  [R0603]  34.89 42.55 0 bottom
R243  4.7Ω  [R0603]  26.83 47.88 270 bottom
R244  4.7Ω  [R0603]  50.39 44.33 0 bottom
R245  4.7Ω  [R0603]  50.39 42.55 0 bottom
R246  4.7Ω  [R0603]  42.33 47.88 270 bottom
R247  4.7Ω  [R0603]  65.89 44.33 0 bottom
R248  4.7Ω  [R0603]  65.89 42.55 0 bottom
R249  4.7Ω  [R0603]  57.83 47.88 270 bottom
R250  4.7Ω  [R0603]  81.39 44.33 0 bottom
R251  4.7Ω  [R0603]  81.39 42.55 0 bottom
R252  4.7Ω  [R0603]  73.32 47.88 270 bottom
SCREW1  -  [Screw-Hole-M4]  5 95 0 top
SCREW2  -  [Screw-Hole-M4]  5 5 0 top
SCREW3  -  [Screw-Hole-M4]  145 5 0 top
SCREW4  -  [Screw-Hole-M4]  145 95 0 top
U1  XJNG2103  [SOIC-8_L4.9-W3.9-P1.27-LS6.0-BL]  77.03 54.03 0 top
U2  1N5819W  [SOD-123_L2.7-W1.6-LS3.7-FD]  73.09 55.81 90 top
U3  LM2596HVS-12/TR  [TO-263-5_L10.6-W9.6-P1.70-LS15.9-BR]  6.32 69.22 90 top
U12  AMS1117-3.3  [SOT-223-4_L6.5-W3.5-P2.30-LS7.0-BR]  16.38 64.26 0 top
U14  BATT_0  [CONN-TH_10P-P3.50_MX15EDGRM-3.5-10P-GN01-CU-A]  50 92 180 top
U15  BATT_1  [CONN-TH_10P-P3.50_MX15EDGRM-3.5-10P-GN01-CU-A]  50 8 0 top
U17  SN74LVC1G125DBVR  [SOT-23-5_L3.0-W1.7-P0.95-LS2.8-BL]  20.37 53.19 0 top
U18  XJNG2103  [SOIC-8_L4.9-W3.9-P1.27-LS6.0-BL]  61.53 54.03 0 top
U19  1N5819W  [SOD-123_L2.7-W1.6-LS3.7-FD]  57.59 55.81 90 top
U20  XJNG2103  [SOIC-8_L4.9-W3.9-P1.27-LS6.0-BL]  139.41 54.06 0 top
U21  1N5819W  [SOD-123_L2.7-W1.6-LS3.7-FD]  135.72 55.85 90 top
U22  XJNG2103  [SOIC-8_L4.9-W3.9-P1.27-LS6.0-BL]  123.91 54.06 0 top
U23  1N5819W  [SOD-123_L2.7-W1.6-LS3.7-FD]  120.22 55.85 90 top
U24  XJNG2103  [SOIC-8_L4.9-W3.9-P1.27-LS6.0-BL]  108.41 54.06 0 top
U25  1N5819W  [SOD-123_L2.7-W1.6-LS3.7-FD]  104.72 55.85 90 top
U26  XJNG2103  [SOIC-8_L4.9-W3.9-P1.27-LS6.0-BL]  92.91 54.19 0 top
U27  1N5819W  [SOD-123_L2.7-W1.6-LS3.7-FD]  89.22 55.85 90 top
U28  XJNG2103  [SOIC-8_L4.9-W3.9-P1.27-LS6.0-BL]  91.84 45.68 180 top
U29  1N5819W  [SOD-123_L2.7-W1.6-LS3.7-FD]  95.72 44.15 270 top
U30  XJNG2103  [SOIC-8_L4.9-W3.9-P1.27-LS6.0-BL]  107.34 45.68 180 top
U31  1N5819W  [SOD-123_L2.7-W1.6-LS3.7-FD]  111.22 44.15 270 top
U32  XJNG2103  [SOIC-8_L4.9-W3.9-P1.27-LS6.0-BL]  122.84 45.68 180 top
U33  1N5819W  [SOD-123_L2.7-W1.6-LS3.7-FD]  126.72 44.15 270 top
U34  XJNG2103  [SOIC-8_L4.9-W3.9-P1.27-LS6.0-BL]  138.34 45.68 180 top
U35  1N5819W  [SOD-123_L2.7-W1.6-LS3.7-FD]  142.22 44.15 270 top
U36  XJNG2103  [SOIC-8_L4.9-W3.9-P1.27-LS6.0-BL]  46.03 54.03 0 top
U37  1N5819W  [SOD-123_L2.7-W1.6-LS3.7-FD]  42.09 55.81 90 top
U38  XJNG2103  [SOIC-8_L4.9-W3.9-P1.27-LS6.0-BL]  30.53 54.03 0 top
U39  1N5819W  [SOD-123_L2.7-W1.6-LS3.7-FD]  26.59 55.81 90 top
U40  XJNG2103  [SOIC-8_L4.9-W3.9-P1.27-LS6.0-BL]  29.97 45.66 180 top
U41  1N5819W  [SOD-123_L2.7-W1.6-LS3.7-FD]  33.84 44.14 270 top
U42  XJNG2103  [SOIC-8_L4.9-W3.9-P1.27-LS6.0-BL]  45.47 45.66 180 top
U43  1N5819W  [SOD-123_L2.7-W1.6-LS3.7-FD]  49.34 44.14 270 top
U44  XJNG2103  [SOIC-8_L4.9-W3.9-P1.27-LS6.0-BL]  60.97 45.66 180 top
U45  1N5819W  [SOD-123_L2.7-W1.6-LS3.7-FD]  64.84 44.14 270 top
U46  XJNG2103  [SOIC-8_L4.9-W3.9-P1.27-LS6.0-BL]  76.47 45.66 180 top
U47  1N5819W  [SOD-123_L2.7-W1.6-LS3.7-FD]  80.34 44.14 270 top
U48  XJNG2103  [SOIC-8_L4.9-W3.9-P1.27-LS6.0-BL]  76.94 54.23 180 bottom
U49  1N5819W  [SOD-123_L2.7-W1.6-LS3.7-FD]  81.01 55.89 90 bottom
U50  XJNG2103  [SOIC-8_L4.9-W3.9-P1.27-LS6.0-BL]  61.44 54.23 180 bottom
U51  1N5819W  [SOD-123_L2.7-W1.6-LS3.7-FD]  65.51 55.89 90 bottom
U52  XJNG2103  [SOIC-8_L4.9-W3.9-P1.27-LS6.0-BL]  45.94 54.23 180 bottom
U53  1N5819W  [SOD-123_L2.7-W1.6-LS3.7-FD]  50.01 55.89 90 bottom
U54  XJNG2103  [SOIC-8_L4.9-W3.9-P1.27-LS6.0-BL]  30.44 54.23 180 bottom
U55  1N5819W  [SOD-123_L2.7-W1.6-LS3.7-FD]  34.51 55.89 90 bottom
U56  XJNG2103  [SOIC-8_L4.9-W3.9-P1.27-LS6.0-BL]  30.64 45.73 0 bottom
U57  1N5819W  [SOD-123_L2.7-W1.6-LS3.7-FD]  26.76 44.07 270 bottom
U58  XJNG2103  [SOIC-8_L4.9-W3.9-P1.27-LS6.0-BL]  46.14 45.73 0 bottom
U59  1N5819W  [SOD-123_L2.7-W1.6-LS3.7-FD]  42.26 44.07 270 bottom
U60  XJNG2103  [SOIC-8_L4.9-W3.9-P1.27-LS6.0-BL]  61.63 45.73 0 bottom
U61  1N5819W  [SOD-123_L2.7-W1.6-LS3.7-FD]  57.76 44.07 270 bottom
U62  XJNG2103  [SOIC-8_L4.9-W3.9-P1.27-LS6.0-BL]  77.13 45.73 0 bottom
U63  1N5819W  [SOD-123_L2.7-W1.6-LS3.7-FD]  73.26 44.07 270 bottom

## Footprints (pads in the part's own frame, mm; a bottom-side part is the same pattern mirrored in y, then rotated)
C0603
  rect 0.8x0.9 smd: 1(-0.7,0) 2(0.7,0)
C0805
  rect 1.41x1.35 smd: 1(-1,0) 2(1,0)
CAP-SMD_BD5.0-L5.3-W5.3-LS6.0-FD
  rect 2.8x1.1 smd: 1(-2.1,0) 2(2.1,0)
CAP-SMD_BD6.3-L6.6-W6.6-LS7.6-RD
  rect 3.5x1.2 smd: 1(-2.67,0) 2(2.67,0)
CAP-SMD_BD10.0-L10.3-W10.3-LS11.0-FD
  rect 4.5x1.65 smd: 1(-4.5,0) 2(4.5,0)
CAP-SMD_BD16.0-L17.0-W17.0-FD-LS18.0
  rect 8.5x2.6 smd: 1(-7.093,0) 2(7.093,0)
CONN-TH_4P-P3.50_MAX_MX15EDGRM-3.5-04P-GN01-CU-A
  round 2 hole 1.4: 1(-5.25,0) 2(-1.75,0) 3(1.75,0) 4(5.25,0)
CONN-TH_10P-P3.50_MX15EDGRM-3.5-10P-GN01-CU-A
  rect 2x2 hole 1.4: 1(-15.75,0.001)
  round 2 hole 1.4: 2(-12.25,-0.001) 3(-8.75,-0.001) 4(-5.25,-0.001) 5(-1.75,-0.001) 6(1.75,-0.001) 7(5.25,-0.001) 8(8.75,-0.001) 9(12.25,-0.001) 10(15.75,-0.001)
F1206
  rect 1.19x1.728 smd: 1(-1.445,0) 2(1.445,0)
IND-SMD_L12.5-W12.5
  rect 3.824x5.82 smd: 1(5.178,0) 2(-5.178,0)
LED0603-RD-YELLOW
  rect 0.8x0.8 smd: 1(-0.799,-0.004) 2(0.799,0.004)
R0603
  rect 0.806x0.864 smd: 1(-0.753,0) 2(0.753,0)
Screw-Hole-M4
  round 4.5 hole 4: 1(0,0)
SMA_L4.3-W2.6-LS5.2-RD
  rect 2x2 smd: 1(-2.2,0) 2(2.2,0)
SOD-123_L2.7-W1.6-LS3.7-FD
  rect 0.88x0.96 smd: 1(-1.61,0) 2(1.61,0)
SOIC-8_L4.9-W3.9-P1.27-LS6.0-BL
  oval 0.588x2.045 smd: 1(-1.905,-2.772) 2(-0.635,-2.772) 3(0.635,-2.772) 4(1.905,-2.772) 5(1.905,2.772) 6(0.635,2.772) 7(-0.635,2.772) 8(-1.905,2.772)
SOT-23-5_L3.0-W1.7-P0.95-LS2.8-BL
  rect 0.49x1.157 smd: 1(-0.95,-1.153) 2(0,-1.153) 3(0.95,-1.153)
  rect 0.49x1.175 smd: 4(0.95,1.153) 5(-0.95,1.153)
SOT-223-4_L6.5-W3.5-P2.30-LS7.0-BR
  rect 2.47x0.98 smd: 1(2.835,-2.3) 2(2.835,0) 3(2.835,2.3)
  rect 2.47x3.6 smd: 4(-2.835,0)
TO-263-5_L10.6-W9.6-P1.70-LS15.9-BR
  rect 3.358x1.02 smd: 1(5.184,-3.4) 2(5.184,-1.7) 3(5.184,0) 4(5.184,1.7) 5(5.184,3.4)
  rect 7.83x10.431 smd: 6(-5.184,0)
WDFN-5_L3.1-W3.1-P0.65-BL_1
  rect 0.42x0.66 smd: 1(-0.975,-0.735) 2(-0.325,-0.735) 3(0.325,-0.735) 4(0.975,-0.735)
  custom 3.48x2.265 smd: 5(0,0.735)

## Nets
As in the schematic.

Pads without a net: SCREW1 1; SCREW2 1; SCREW3 1; SCREW4 1; U14 10

## Via types
v1: diameter 0.61, hole 0.305, Top Layer to Bottom Layer, 266 vias

## Routing (per net, layer and track width the routed paths; a pad name or vN(x,y) marks a point on that pad's centre or on a via; arc(x,y) is an arc through that point)
+12V: length 582.8
  Top Layer w0.254: 137.56,46.48 137.62,46.53 140,46.53 140.15,46.69 140.15,48.47 ; 141.37,53.36 138.02,53.36 137.48,52.82 137.48,51.37 ; 31.95,48.47 31.95,46.74 31.61,46.41 ; 60.68,46.4 62.44,46.4 62.81,46.78 62.81,48.43 ; 142.1,48.53 142.08,48.56 140.29,48.56 ; 95.63,48.65 95.55,48.57 93.74,48.57 ; 47.35,48.42 47.35,46.59 47.16,46.41 44.22,46.41 ; 47.42,48.49 49.26,48.49 49.45,48.68 ; 73.17,51.21 73.21,51.25 75.04,51.25 ; 44.08,51.15 44.08,52.36 45.2,53.48 49.82,53.48 ; 31.8,48.66 33.7,48.66 33.77,48.59 ; 124.81,48.49 124.81,48.41 ; 124.81,48.41 124.81,46.68 124.52,46.39 121.4,46.39 ; 124.81,48.41 126.39,48.41 126.61,48.63 ; 111.09,48.52 109.35,48.52 ; 78.37,48.59 78.37,46.73 78.08,46.44 74.45,46.44 ; 137.48,51.37 135.91,51.37 135.83,51.28 ; 137.48,51.37 137.48,51.35 ; 59.65,51.31 59.65,52.68 60.35,53.39 65.23,53.39 ; 78.48,53.26 75.42,53.3 75.11,53 75.11,51.41 ; 25.91,46.36 25.85,46.3 16.81,46.3 12.75,42.24 12.75,22.39 ; 89.96,46.45 93.12,46.45 93.72,47.05 93.72,48.55 ; 26.51,51.22 28.63,53.34 34.27,53.33 ; 125.31,53.43 122.26,53.43 122.08,53.25 122.08,51.55 121.93,51.4 ; 31.61,46.45 29.66,46.45 ; 94.86,53.41 91.56,53.41 90.85,52.7 90.85,51.52 90.69,51.35 89.42,51.35 ; 28.65,51.1 26.91,51.1 26.7,51.31 ; 104.75,51.21 104.77,51.19 106.42,51.19 ; 42.1,51.11 42.18,51.18 44.07,51.18 ; 64.87,48.6 63.01,48.6 62.89,48.47 ; 106.42,51.36 106.53,51.47 106.53,53.16 106.71,53.34 109.27,53.34 109.3,53.31 ; 80.25,48.57 80.19,48.5 78.45,48.5 ; 120.48,51.29 121.94,51.29 121.97,51.32 ; 57.76,51.04 59.27,51.04 59.58,51.34 ; 109.22,48.51 109.22,46.96 108.66,46.4 105.46,46.4
  Top Layer w0.5: 65.29,53.18 65.23,53.18 ; 119.12,46.36 121.31,46.36 ; 141.29,53.3 143.12,53.3 ; 103.64,46.52 105.4,46.52 ; 112.26,53.37 v1(109.3,53.37) ; 19.04,66.54 16.89,66.54 v1(16.82,66.48) ; 57.24,46.37 60.57,46.37 ; 72.81,46.41 74.38,46.41 ; 127.75,53.32 125.47,53.32 ; 88.05,46.37 89.79,46.37 ; v1(94.74,53.31) 96.59,53.31 96.69,53.42 ; 134.74,46.41 134.78,46.44 v1(137.64,46.44) ; 41.83,46.45 44.16,46.45 ; 26.11,46.29 29.48,46.29 ; 80.81,53.26 78.48,53.26
  Top Layer w1: 19.27,66.62 19.27,66.79 17.36,68.7 17.36,69.86 ; 14.94,69.92 14.92,69.89 ; 4.64,75.48 4.64,81.67 2.54,83.77 ; 18.83,69.87 5.84,69.87 4.64,71.08 4.64,73.82
  Inner2 w0.5: 60.5,46.43 v1(44.18,46.43) v1(29.62,46.43) ; 29.69,46.49 29.69,48.13 32.62,51.06 32.62,53.3 ; 121.4,46.43 v1(105.49,46.43) 74.51,46.43 ; 121.69,46.39 121.73,46.43 137.63,46.43 v1(137.64,46.44) ; v1(16.82,66.48) 16.82,59.77 23.29,53.31 32.59,53.31 141.23,53.33 v1(141.25,53.35) ; 74.46,46.43 60.52,46.43
  Bottom Layer w0.254: 63.61,53.24 63.61,51.88 63.37,51.64 ; 80.86,51.31 80.66,51.51 78.88,51.51 ; 57.89,48.62 59.65,48.62 59.72,48.7 ; 42.24,48.59 44.19,48.59 ; 49.91,51.3 49.66,51.55 47.92,51.55 ; 73.1,53.57 70.49,53.57 68.2,51.29 65.57,51.29 ; 50.08,46.21 53.49,46.21 55.92,48.64 57.79,48.64 ; 75.25,48.48 75.05,48.68 73.29,48.68 ; 65.59,46.48 69.39,46.48 71.55,48.64 73.13,48.64 ; 50.15,51.24 50.39,51.48 52.67,51.48 54.88,53.68 57.38,53.68 ; 63.37,51.64 63.31,51.58 ; 63.37,51.64 65,51.64 65.4,51.24 ; 29.56,46.49 28.74,47.31 28.74,48.61 ; 42.18,48.75 40.6,48.75 38.27,46.41 34.62,46.41 ; 59.74,48.55 59.74,47 59.69,46.95 59.69,46.7 59.87,46.52 60.53,46.52 60.61,46.44 ; 44.21,48.57 44.3,48.48 ; 78.43,53.25 78.82,52.86 78.82,51.36 ; 32.64,53.33 32.64,51.7 32.53,51.59 ; 32.53,51.59 33.97,51.59 34.31,51.26 ; 32.53,51.59 32.39,51.45 ; 42.01,53.66 39.62,53.66 37.28,51.32 34.48,51.32 ; 26.9,48.42 28.59,48.42 ; 44.18,46.55 44.18,48.55 ; 75.23,48.34 75.23,46.44
  Bottom Layer w0.5: 47.76,53.34 47.64,53.47 42.33,53.47 ; 34.39,46.47 29.65,46.47 ; 80.98,46.49 80.94,46.44 74.48,46.44 ; 57.64,53.34 63.39,53.34 ; 26.59,53.36 32.56,53.36 ; 49.98,46.55 44.18,46.55 ; 44.09,46.47 44.08,46.46
  vias: v1(32.59,53.31) v1(47.79,53.32) v1(60.69,46.41) v1(63.51,53.27) v1(74.45,46.44) v1(78.46,53.26) v1(89.84,46.42) v1(121.4,46.39) v1(125.44,53.3)
GND: length 38
  Top Layer w0.254: 32.33,51.14 32.46,51.27 34.43,51.27 ; 78.91,51.38 80.58,51.38 80.61,51.35 ; 47.86,51.31 47.87,51.3 49.65,51.3 ; 65.14,51.33 65.1,51.28 63.4,51.28 ; 59.02,48.52 58.99,48.49 57.15,48.49 ; 26.2,48.4 26.51,48.71 27.89,48.71 ; 43.5,48.56 43.45,48.5 41.77,48.5
  Top Layer w0.5: 49.96,51.23 53.17,51.23 v1(53.48,50.92) ; v1(23.61,48.31) 23.64,48.34 25.99,48.34 ; v1(82.65,51.37) 81.13,51.37 80.99,51.23
  Top Layer w1: 83.82,87.67 83.95,87.54 83.95,83.76 84.23,83.48 ; 83.45,88.51 83.45,89.94 85.17,91.67
  Bottom Layer w0.254: 32.51,48.58 34.34,48.58 ; 47.9,48.5 49.83,48.5 49.94,48.6 ; 63.64,48.52 65.07,48.52 65.13,48.58 ; 79.07,48.56 80.82,48.56 80.88,48.5
  Bottom Layer w0.5: v1(36.32,48.48) 36.31,48.49 34.51,48.49
VCC: length 29.4
  Top Layer w0.5: 13.48,58.75 13.53,58.8 18.83,58.8 18.91,58.72 18.91,57.26 ; 18.91,57.09 18.91,57.15 ; 18.91,57.15 18.8,57.26 ; 18.91,57.15 19.38,56.69 19.38,54.26
  Top Layer w1: 13.18,64.24 13.06,64.36 ; 13.57,64.02 13.57,58.8 ; 13.57,58.75 13.57,57.49 ; 13.6,57.45 13.59,57.45 11.94,55.8 7.16,55.8 ; 18.97,64.24 13.57,64.24
ACT_BAL_EN: length 81.6
  Top Layer w0.254: 62.1,8.15 60.78,9.47 31.19,9.47 30.94,9.22 30.45,9.22 30.21,9.47 26.74,9.47 v1(24.9,11.32) ; 19.32,51.85 19.72,51.44 v1(19.72,49.67)
  Inner2 w0.254: v1(24.9,11.32) 19.72,16.49 v1(19.72,49.67)
ACT_BAL_PWM: length 91.8
  Top Layer w0.254: 65.87,7.97 60.59,2.69 v1(50.35,2.69) ; 20.32,52.22 20.32,50.03 v1(20.72,49.63)
  Inner1 w0.254: v1(20.72,49.63) 20.72,30.34 20.55,30.17 20.55,15.68 20.72,15.51 20.72,11.87 29.89,2.69 v1(50.35,2.69)
B1+: length 27.7
  Top Layer w1: v1(78.13,97.19) 81.12,97.19 81.53,96.78 81.53,94.49
  Inner2 w1: v1(78.13,97.19) 63.25,97.19 v1(62.3,96.24)
  Bottom Layer w1: 62.15,94.54 62.3,94.68 62.3,94.82 ; 63.82,94.8 63.79,94.82 62.3,94.82 ; 62.3,94.82 v1(62.3,96.24) ; 62.32,92.16 62.32,94.5
B1-: length 52
  Top Layer w1: 85.05,94.65 111.53,94.65 v1(111.55,94.63) ; v1(85.09,96.01) 85.04,95.97 85.04,94.51
  Inner2 w1: v1(66.87,95.93) 85,95.93 v1(85.09,96.01)
  Bottom Layer w1: v1(111.55,94.63) 113.19,94.63 ; 65.75,92.14 65.75,94.46 ; v1(66.87,95.93) 65.64,94.7 65.64,94.66
B2+: length 26.5
  Top Layer w1: 58.81,96.43 60.11,97.73 74.97,97.73 78.16,94.54
  Bottom Layer w1: v1(58.82,96.41) 58.82,94.84 58.68,94.7 ; 58.87,94.77 60.15,94.77 60.16,94.76 60.32,94.76 ; 58.84,92.36 58.84,94.45
B3+: length 46
  Bottom Layer w1: 19.61,94.47 19.61,97.74 20.83,98.96 52.39,98.96 55.04,96.31 55.04,94.87 ; 55.07,94.81 55.07,92.22 55.29,92.01 ; 56.77,94.73 56.76,94.72 55.36,94.72
B4+: length 28
  Inner2 w1: v1(55.04,98.96) 53.07,98.96 v1(51.85,97.73)
  Bottom Layer w1: 71.17,94.67 66.88,98.96 v1(55.04,98.96) ; 51.93,94.72 53.25,94.72 53.26,94.71 ; 51.87,94.74 51.85,94.77 51.85,97.65 ; 51.82,92.38 51.82,94.51
B5+: length 34.9
  Inner2 w1: v1(48.3,96.6) 55,96.6 57.31,98.91 v1(69.83,98.91)
  Bottom Layer w1: v1(69.83,98.91) 70.27,98.91 74.63,94.55 ; 50,94.75 49.9,94.75 49.87,94.72 48.56,94.72 ; 48.06,92.07 48.06,93.55 ; 48.3,94.69 48.3,94.7 v1(48.3,96.6) ; 48.3,94.69 48.3,93.72
B6+: length 21.2
  Inner2 w1: v1(32.23,96.47) v1(44.74,96.47)
  Bottom Layer w1: v1(32.23,96.47) 32.23,96.37 30.32,94.46 30.28,94.46 ; 46.43,94.75 46.42,94.74 45.04,94.74 ; 44.77,91.99 44.77,94.8 ; 44.77,94.83 44.77,96.44 v1(44.74,96.47)
B7+: length 24.8
  Inner2 w1: v1(27.03,96.03) 29.87,98.86 40.15,98.86 41.27,97.74 v1(41.31,97.74)
  Bottom Layer w1: 43.2,94.73 43.19,94.72 41.31,94.72 ; 26.81,94.66 26.81,95.81 v1(27.03,96.03) ; 41.34,94.75 41.31,94.77 v1(41.31,97.74) ; 41.34,92.11 41.34,94.62
B8+: length 156.4
  Top Layer w1: v1(11.44,91.38) 12.84,92.78 30.46,92.78 31.89,94.2 36.05,94.2 36.76,93.5 36.76,92.46 37.62,91.6
  Inner2 w1: v1(11.44,91.38) 11.44,72.85 11.39,72.79 11.39,72 11.44,71.94 11.44,13.24 18.13,6.56 v1(30.53,6.56)
  Bottom Layer w1: 32.65,5.45 31.63,5.45 v1(30.53,6.56) ; 23.23,94.5 23.23,96.9 24.04,97.71 38.87,97.71 39.77,96.81 39.77,94.62 39.81,94.59 ; 37.7,92.1 39.75,94.15
B9+: length 16.3
  Inner2 w1: v1(26.26,3.22) 34.14,3.22 v1(34.24,3.31)
  Bottom Layer w1: 34.26,5.36 36.09,5.36 36.11,5.34 ; 34.26,5.36 34.26,3.31 ; 34.26,5.36 34.22,5.36 ; v1(26.26,3.22) 24.64,4.84 24.64,5.21 ; 34.11,7.96 34.11,6.25
B10+: length 19.2
  Bottom Layer w1: 39.69,5.4 37.88,5.4 ; 37.88,5.4 37.88,3.15 35.76,1.03 32.21,1.03 29.47,3.78 29.47,3.87 28.07,5.27 ; 37.88,5.4 37.88,5.43 ; 37.72,5.46 37.68,5.43 37.68,7.95
B11+: length 45
  Bottom Layer w1: 41.35,5.14 41.26,5.05 41.26,2.52 42.69,1.09 74.13,1.09 74.38,1.34 74.38,5.54 ; 41.02,7.81 41.28,7.55 41.28,5.33 ; 43.28,5.35 41.52,5.35
B12+: length 43.7
  Inner2 w1: v1(76.37,1.4) 45.77,1.4 44.78,2.4 v1(44.78,3.61)
  Bottom Layer w1: v1(44.78,3.61) 44.78,5.29 44.87,5.39 ; 44.88,5.44 44.88,7.53 44.8,7.62 ; 78.05,5.45 78.05,3.08 v1(76.37,1.4) ; 46.56,5.35 44.86,5.35
B13+: length 40.5
  Top Layer w1: 48.17,7.92 48.42,7.68 48.42,2.15 49.12,1.44 74.09,1.44 74.47,1.81 74.47,5.74
  Bottom Layer w1: 48.19,5.42 50.03,5.42 50.08,5.37 ; 48.32,7.78 48.32,5.53
B14+: length 34.2
  Top Layer w1: 77.86,5.39 77.86,4.49 v1(76.02,2.65)
  Inner2 w1: v1(76.02,2.65) 52.42,2.65 v1(51.69,3.37)
  Bottom Layer w1: v1(51.69,3.37) 51.69,5.3 51.71,5.32 ; 51.71,5.4 53.53,5.4 53.57,5.36 ; 51.7,5.41 51.7,5.4 ; 51.78,7.67 51.78,5.49
B15+: length 33.2
  Top Layer w1: v1(80.56,3.92) 81.83,5.19 81.83,5.64
  Inner2 w1: v1(80.56,3.92) 80.54,3.89 55.49,3.89 55.43,3.95 v1(55.28,3.95)
  Bottom Layer w1: 57.1,5.45 57.06,5.41 55.21,5.41 ; 55.33,7.89 55.33,5.62 ; v1(55.28,3.95) 55.28,5.39 55.26,5.41
B16+: length 58.9
  Top Layer w1: 84.97,5.57 86.8,5.57 v1(86.94,5.44)
  Inner2 w1: v1(86.94,5.44) 86.87,5.37 v1(60.17,5.37)
  Bottom Layer w1: 58.71,5.43 58.77,5.37 v1(60.17,5.37) ; 86.89,5.38 113.03,5.38 113.12,5.46 ; 58.89,7.84 58.89,5.5
BAL_SIG: length 182.5
  Top Layer w0.254: 106.76,48.52 106.76,49.55 106.62,49.69 ; 76.12,49.89 76.48,50.25 76.48,50.96 ; 77.62,51.2 77.56,51.14 76.49,51.14 ; 29.46,49.87 36.87,49.87 36.89,49.88 44.78,49.88 ; 29.46,49.87 29.46,48.8 ; 29.46,49.87 29.46,50.75 29.8,51.08 ; 62.07,51.29 60.94,51.29 ; 92.2,51.21 92.23,51.19 92.23,49.86 ; 138.66,51.06 138.71,51.06 ; 138.71,51.06 138.71,51.17 ; 138.71,51.06 138.71,49.84 138.59,49.71 137.66,49.71 137.66,48.34 ; 138.71,51.06 139.81,51.06 139.96,51.21 ; 60.83,51.29 60.78,51.34 ; 75.88,48.52 75.88,48.52 75.81,48.52 ; 60.36,49.87 75.88,49.86 ; 46.14,48.52 44.86,48.52 ; 92.38,51.25 92.44,51.31 93.44,51.31 ; 137.83,48.41 138.96,48.41 139.04,48.49 ; 45.36,49.92 45.36,51.2 45.26,51.29 ; 21.28,54.39 21.28,54.33 21.44,54.17 22.79,54.17 24.99,51.97 24.99,49.95 25.17,49.77 29.42,49.77 ; 123.45,48.5 123.45,49.64 ; 75.88,48.94 75.88,49.66 ; 75.88,48.94 76.84,48.94 77,49.09 ; 75.88,48.94 75.87,48.94 ; 60.76,49.89 60.94,50.06 60.94,51.2 ; 123.28,49.84 123.37,49.76 ; 123.28,49.84 137.66,49.84 ; 123.28,49.84 107.7,49.85 ; 107.7,51.11 107.7,49.85 ; 107.7,49.85 92.23,49.86 ; 29.46,48.53 30.38,48.53 30.5,48.65 ; 29.88,51.27 31.11,51.27 ; 124.43,51.3 124.37,51.23 123.12,51.23 ; 61.76,48.59 61.74,48.61 60.26,48.61 ; 60.26,49.87 44.8,49.88 ; 108.99,51.27 108.88,51.38 107.66,51.38 ; 44.8,48.47 44.75,48.41 ; 122.15,48.29 123.31,48.29 ; 91.08,48.46 91.11,48.43 ; 92.23,49.86 76.12,49.86 ; 46.62,51.35 46.5,51.24 45.38,51.24 ; 123.26,51.05 123.26,49.87 ; 107.88,48.47 106.73,48.47 ; 44.77,48.5 44.77,49.82 ; 60.23,48.72 60.23,49.78 ; 91.12,48.44 91.12,49.72 ; 92.47,48.35 91.19,48.35
  Bottom Layer w0.254: 76.29,51.53 77.52,51.53 77.71,51.71 ; 60.37,49.88 60.78,50.29 60.78,51.38 ; 60.37,49.88 61.08,49.16 61.08,48.61 ; 60.37,49.88 60.33,49.84 ; 31.23,48.64 31.17,48.59 30.01,48.59 ; 61.03,48.48 62.06,48.48 62.19,48.61 ; 30.01,48.59 30.01,48.52 ; 30.01,48.59 30.01,49.2 29.43,49.78 ; 30.01,48.59 29.98,48.59 ; 29.79,51.27 29.79,50.18 29.43,49.82 ; 75.91,49.84 75.91,49.84 ; 75.91,49.84 76.41,49.34 76.41,49.04 ; 75.91,49.84 76.21,50.13 76.21,51.17 ; 44.8,49.85 45.36,50.41 45.36,51.53 ; 44.8,49.85 45.48,49.17 45.48,48.75 ; 44.8,49.85 v1(44.78,49.83) ; 76.43,48.5 77.77,48.5 77.88,48.61 ; 45.42,51.66 46.34,51.66 46.48,51.52 ; 45.47,48.59 46.59,48.59 ; 60.98,51.55 62.14,51.55 ; 31.13,51.55 31.12,51.56 29.77,51.56
  vias: v1(29.44,49.77) v1(60.36,49.88) v1(75.9,49.83)
BN1+: length 21.4
  Top Layer w1: v1(104.16,2.09) 101.92,2.09 101.61,2.41 101.61,3.88
  Bottom Layer w1: 114.84,5.4 116.57,5.4 116.59,5.38 ; 114.66,5.48 114.66,8.06 ; v1(104.16,2.09) 112.87,2.09 114.69,3.92 114.69,5.44 114.65,5.48
BN2+: length 25.5
  Top Layer w1: 118.29,1.72 117.58,1.01 108.32,1.01 105.33,4 ; 118.35,3.42 118.33,3.44 118.33,8.1 ; 118.33,1.72 118.33,3.42
  Bottom Layer w1: 120.27,5.38 120.23,5.42 118.38,5.42 ; 118.21,5.38 118.21,8.02 118.23,8.04
BN3+: length 25.4
  Top Layer w1: 133.88,3.91 133.88,1.4 133.72,1.23 122.37,1.23 121.67,1.94 121.67,7.77 121.77,7.88
  Bottom Layer w1: 121.87,5.36 123.72,5.36 123.76,5.32 ; 121.85,5.38 121.78,5.32 ; 121.91,7.79 121.91,5.44
BN4+: length 19.9
  Top Layer w1: v1(136.89,1.38) 137.71,2.19 137.71,3.89
  Bottom Layer w1: 125.37,5.45 125.28,5.37 125.28,3.66 127.57,1.38 v1(136.89,1.38) ; 125.46,5.4 125.46,7.79 125.25,8
BP12+: length 13.1
  Inner2 w1: v1(133.18,96.11) 125.35,96.11
  Bottom Layer w1: v1(133.18,96.11) 133.62,95.67 133.62,94.84 ; 125.36,94.74 125.37,94.75 125.37,96.11 ; 125.24,94.62 125.22,94.63 ; 125.43,92.04 125.43,94.43
  vias: v1(125.35,96.09)
BP13+: length 17.1
  Bottom Layer w1: 123.75,94.86 122.09,94.86 ; 122.09,94.86 122.09,94.82 ; 122.09,94.86 122.08,94.88 122.08,96.61 123.2,97.73 129.37,97.73 130.07,97.03 130.07,95.09 130.11,95.06 130.11,94.39 ; 121.86,92.29 121.86,94.55
BP14+: length 16.5
  Inner2 w1: v1(109.33,96.27) v1(118.29,96.27)
  Bottom Layer w1: 118.39,94.78 118.35,94.74 ; v1(109.33,96.27) 108.88,95.83 108.88,94.55 ; 120.2,94.78 118.62,94.78 ; 118.39,92.2 118.39,94.59 ; 118.62,94.75 118.29,95.08 v1(118.29,96.27)
BP15+: length 20.3
  Bottom Layer w1: 114.98,94.97 114.98,97.29 114.27,98 105.62,98 105.39,97.78 105.39,94.71 ; 115.01,94.93 114.86,94.78 ; 114.86,94.78 116.67,94.78 ; 114.86,94.78 114.78,94.7 ; 114.69,91.87 114.69,94.61
C+: length 340.2
  Top Layer w1: 36.18,77.09 36.18,78.66 36.2,78.67 ; 51.55,78.63 51.62,78.56 51.62,77.18 ; 82.83,77.2 82.33,77.7 v1(82.33,78.6) ; 86.04,22.7 86.9,21.84 86.9,21.36 ; 113.63,77.23 112.6,78.26 v1(112.6,78.58) ; 129.06,77.13 128.11,78.09 v1(128.11,78.61) ; 132.64,22.78 133.48,21.93 v1(133.48,21.12) ; v1(97.15,78.59) 97.15,78.1 98.05,77.2 ; 71.57,21.35 71.57,21.55 70.71,22.4 ; 20.78,78.67 20.45,78.34 20.45,77.13 ; 66.78,78.6 67,78.38 67,77.11 ; 148.43,22.73 148.43,21.61 v1(148.92,21.11) ; 55.93,21.33 55.93,21.6 55.14,22.39 ; v1(102.19,21.28) 101.57,21.91 101.57,22.65 ; v1(118.14,21.13) 118.14,21.4 116.81,22.73 ; 40.31,21.35 39.44,22.22 39.44,22.26
  Inner2 w1: 133.49,21.17 133.55,21.11 v1(148.92,21.11) ; v1(20.82,78.67) v1(36.23,78.67) ; 51.57,78.69 51.64,78.62 66.78,78.62 97.15,78.62 ; v1(51.59,78.67) 36.28,78.67 36.28,78.67 ; v1(102.19,21.28) 87,21.28 86.98,21.3 ; 55.72,21.34 55.7,21.31 v1(40.35,21.31) ; 55.76,21.29 v1(86.95,21.29) ; 112.6,78.61 128.11,78.61 ; v1(133.48,21.12) 118.24,21.12 118.19,21.16 ; 55.95,21.33 v1(55.97,21.31)
  Bottom Layer w0.5: 84.21,21.31 85.33,21.31 85.35,21.29
  Bottom Layer w1: 69.18,78.62 v1(66.79,78.62) ; 97.16,78.86 108.47,78.86 108.59,78.74 119.34,78.74 119.56,78.96 ; 119.88,21.15 97.76,21.15 97.66,21.24 ; 128.16,78.62 130.25,78.62 131.51,77.36 131.51,69.12 131.97,68.66 131.97,67.86 131.51,67.4 131.51,51.52 126.21,46.22 126.21,26.24 131.34,21.12 133.4,21.12 ; v1(86.95,21.29) 86.92,21.33 85.5,21.33 ; v1(55.97,21.31) 53.79,21.31 ; 53.62,78.68 51.6,78.68 v1(51.59,78.67) ; v1(36.23,78.67) 38.17,78.67 ; v1(40.35,21.31) 40.32,21.35 38.34,21.35 ; v1(20.82,78.67) 20.84,78.69 22.58,78.69 ; v1(71.69,21.34) 69.28,21.34 69.25,21.31
C-: length 388.4
  Top Layer w0.5: 53.12,34.46 52.11,33.44 52.11,33.37 ; 53.14,33.2 53.16,33.18 ; 52.11,33.37 52.47,33.73 53.15,33.73 ; 52.11,33.37 52.11,33.35 ; 52.2,33.12 52.22,33.14 53.08,33.14
  Top Layer w1: 114.89,33.92 113.9,32.94 v1(113.9,30.02) ; 39.64,69.46 39.67,69.44 39.67,66.46 39.26,66.05 38.54,66.05 ; 99.44,34.06 98.64,33.25 v1(98.64,30.01) ; v1(132.62,69.52) 132.62,66.92 131.56,65.85 ; 84.02,33.87 83.6,33.45 83.45,33.45 83.07,33.07 83.07,32.11 83.4,31.78 v1(83.4,30.03) ; 68.42,33.79 67.52,32.9 67.52,30.43 67.84,30.12 ; 115.94,65.73 117.3,67.09 v1(117.3,69.52) ; 36.95,30.05 36.5,30.5 36.5,33.63 36.65,33.79 37.61,33.79 37.66,33.74 ; v1(130.74,29.95) 129.62,31.07 129.62,33.34 129.75,33.34 130.46,34.05 ; 52.01,33.12 52.01,31.22 52.44,30.78 52.44,30.14 ; 54.24,65.73 55.08,66.57 55.08,69.28 55.24,69.43 ; 85.22,65.83 86.31,66.92 86.31,69.5 ; 100.61,65.77 101.78,66.93 v1(101.78,69.49) ; 69.54,65.78 70.74,66.97 70.74,69.52 ; v1(146.8,69.47) 148.11,68.16 148.11,66.94 147.14,65.97 ; 21.91,33.73 21.38,33.73 20.84,33.2 20.84,30.42 21.18,30.08
  Inner2 w1: 86.36,69.52 117.28,69.52 ; v1(21.23,30.03) 36.95,30.03 52.44,30.08 ; 113.9,30 130.7,29.99 v1(130.74,29.95) ; 70.72,69.55 70.65,69.48 v1(39.63,69.48) ; 67.84,30.01 67.86,30.03 83.37,30.03 98.64,30.02 ; v1(146.8,69.47) 146.75,69.52 117.3,69.52 ; v1(70.73,69.53) v1(86.34,69.53) ; 52.46,30.08 52.5,30.04 v1(67.86,30.04)
  Bottom Layer w0.5: 53.4,30.08 54.83,30.07 54.85,30.06 ; 39.34,30.05 39.32,30.03 38.32,30.03
  Bottom Layer w1: v1(52.45,30.08) 53.4,30.08 ; 69.85,30.08 67.89,30.08 v1(67.86,30.04) ; 97.75,69.8 97.78,69.83 119.56,69.83 ; v1(36.98,30.03) 37,30.01 38.18,30.01 ; 84.47,69.55 84.49,69.53 v1(86.34,69.53) ; v1(70.73,69.53) 70.73,69.54 68.97,69.54 ; 119.61,30.17 119.54,30.11 97.45,30.11 ; 53.51,69.49 v1(55.31,69.49) ; v1(39.63,69.48) 39.63,69.47 Q83.1 38.07,69.47 ; 146.88,69.47 142.26,69.47 142.21,69.51 141.21,69.51 140.5,68.81 140.5,53.96 140.29,53.74 140.29,52.95 140.5,52.74 140.5,31.49 138.94,29.93 130.75,29.93 130.69,29.99 ; 23.36,30.03 v1(21.23,30.03)
FU_B1+: length 27.1
  Top Layer w1: v1(64.96,86.91) 66.52,88.47 67.81,88.47 ; 68.36,88.3 68.36,83.9 68.72,83.54 ; v1(77.72,88.24) 80.94,91.46 81.58,91.46
  Inner2 w1: v1(64.96,86.91) 64.96,87.22 65.63,87.88 77.06,87.88 77.41,88.24 v1(77.72,88.24)
FU_B2+: length 40.9
  Top Layer w1: 52.69,88.66 52.69,84.03 52.78,83.95 52.78,83.91 53.26,83.43 ; 77.9,91.56 77.9,90.01 77.84,89.95 v1(74.98,89.95) ; v1(49.17,86.69) 50.85,88.38 52.19,88.38
  Inner2 w1: v1(74.98,89.95) 74.05,89.01 51.49,89.01 v1(49.17,86.69)
FU_B3+: length 25.7
  Top Layer w1: 37.83,83.59 37.83,83.68 37.23,84.28 37.23,87.89 ; 36.55,88.67 34.77,88.67 v1(34.37,89.07)
  Inner2 w1: v1(18.3,89.5) 18.73,89.07 v1(34.37,89.07)
  Bottom Layer w1: 19.85,91.46 18.3,89.9 v1(18.3,89.5)
FU_B4+: length 78
  Top Layer w1: v1(18.49,86.77) 20.17,88.44 21.48,88.44
  Inner2 w1: v1(68.51,91.39) 67.73,90.61 67.76,90.61 67.26,90.11 51.03,90.11 50.26,89.34 39.34,89.34 37.97,87.97 19.69,87.97 v1(18.49,86.77)
  Bottom Layer w1: 70.79,91.6 68.71,91.6 v1(68.51,91.39) ; 84.24,83.43 83.9,83.78 83.9,86.06 83.52,86.45 81.23,86.45 76.53,91.14 76.53,92.8 76.47,92.86 71.9,92.86 70.89,91.84
FU_B5+: length 12.2
  Bottom Layer w1: 74.38,91.59 72.84,90.05 69.79,90.05 68.03,88.29 ; 68.79,83.34 68.87,83.42 68.87,87.77
FU_B6+: length 28.5
  Bottom Layer w1: 53.34,87.77 53.34,84.13 52.8,83.58 ; 30.37,91.64 31.76,90.26 50.23,90.26 52.8,87.69
FU_B7+: length 16.5
  Bottom Layer w1: 37.51,87.97 30.14,87.97 26.83,91.27 ; 37.35,83.45 37.68,83.77 37.68,87.74
FU_B8+: length 83.7
  Bottom Layer w1: 23.23,16.64 23.23,16.34 21.21,14.31 20.21,14.31 18.59,15.93 18.59,85.03 21.77,88.21 ; 21.85,88.21 21.85,88.16 ; 23.32,91.52 23.32,90 21.85,88.53
FU_B9+: length 25.8
  Inner1 w1: v1(31.84,12.07) 36.97,12.07 37.51,12.61 v1(41.64,12.61)
  Bottom Layer w1: v1(31.84,12.07) 27.91,12.07 24.36,8.51 ; 38.62,16.55 38.6,16.53 38.6,12.22 ; v1(41.64,12.61) 41.28,12.24 40.98,12.24 40.95,12.21 39.34,12.21
FU_B10+: length 42.8
  Inner1 w1: v1(59.56,12.64) 56.73,9.81 v1(30.7,9.81)
  Bottom Layer w1: 59.49,12.67 59.24,12.92 56.12,12.92 55.21,12.01 54.64,12.01 ; 54.16,12.21 54.16,16.49 54.09,16.56 ; v1(30.7,9.81) 29.47,9.81 28.16,8.5
FU_B11+: length 14.7
  Bottom Layer w0.254: 69.64,16.68 69.62,16.7 69.07,16.7
  Bottom Layer w1: 74.74,8.41 75.97,9.64 75.97,11.39 75.26,12.09 70.27,12.09 70.17,12.19 ; 69.77,12.08 69.77,16.56
FU_B12+: length 90.9
  Top Layer w1: v1(46.51,3.77) 45.6,4.68 25.76,4.68 22.64,7.81 22.64,16.46 ; 22.64,16.46 22.65,16.44 ; 22.64,16.46 22.44,16.65
  Inner1 w1: v1(46.51,3.77) 49.42,3.77 51.98,6.32 66.46,6.32 68.78,4 76.01,4 77.42,2.6 v1(84.06,2.6)
  Bottom Layer w1: 78.27,8.6 84.96,8.6 85.54,9.18 85.54,12.03 ; 84.23,8.51 83.94,8.22 83.94,2.69
FU_B13+: length 42.4
  Top Layer w1: 39.23,11.63 39.57,11.29 v1(41.38,11.29) ; v1(74.53,10.38) 74.5,10.35 74.5,8.69 ; 38.36,16.21 38.74,15.84 38.74,11.5
  Inner2 w1: v1(74.53,10.38) 42.28,10.38 v1(41.38,11.29)
FU_B14+: length 30.3
  Top Layer w1: 53.92,16.29 54.22,15.99 54.22,12 54.23,11.99 ; 78.39,8.59 78.39,10.19 v1(77.97,10.6) ; v1(56.8,11.6) 56.37,12.03 54.85,12.03
  Inner2 w1: v1(56.8,11.6) 76.97,11.6 v1(77.97,10.6)
FU_B15+: length 18
  Top Layer w1: 69.37,16.29 69.7,15.96 69.7,12.6 ; 81.57,8.61 81.13,9.04 81.13,11.38 80.36,12.16 70.63,12.16 70.35,11.88
FU_B16+: length 183.3
  Top Layer w1: 85.43,11.13 85.25,10.94 85.25,8.61 ; v1(8.69,52.7) 7.01,52.7 ; 85.32,16.4 85.32,12.07 ; 9.91,32.62 7,35.52 7,52.78 ; v1(22.25,24.09) 18.45,24.09 14,19.64 2.72,19.64 2.01,20.35 2.01,24.79 9.73,32.51 ; 85.31,8.58 88.2,8.58 v1(90.78,11.15) ; 9.72,74.58 9.72,76.63 9.7,76.65 9.7,77.49 10.3,78.09 11.14,78.09 12.34,76.88 v1(12.34,72.39)
  Inner1 w1: v1(90.78,11.15) 82.95,18.99 82.83,18.99 82.27,19.55 82.27,19.66 74.1,27.83 25.99,27.83 v1(22.25,24.09)
  Bottom Layer w1: v1(8.69,52.7) 12.34,56.35 v1(12.34,72.39)
FU_BN1+: length 8.9
  Top Layer w1: 101.87,7.03 101.87,10.7 101.18,11.39 ; 100.9,16.32 100.9,12.05
FU_BN2+: length 22.6
  Top Layer w1: 116.41,16.26 116.41,12.29 ; v1(119.58,11.28) 117.15,11.28 116.82,11.61 ; 105.51,7.35 v1(106.68,8.52)
  Inner2 w1: v1(119.58,11.28) 109.44,11.28 v1(106.68,8.52)
FU_BN3+: length 9.3
  Top Layer w1: 133.86,7.07 133.86,9.88 132.28,11.46 ; 131.82,16.4 131.82,12.39 132.03,12.19
FU_BN4+: length 13
  Top Layer w1: 137.75,7.08 139.34,8.67 147.38,8.67 148.09,9.38 148.09,11.09 148.08,11.1
FU_BP12+: length 17.2
  Top Layer w1: v1(146.4,85.07) 146.4,83.82 145.99,83.41
  Bottom Layer w1: v1(146.4,85.07) 140.15,91.33 133.67,91.33
FU_BP13+: length 11
  Top Layer w1: 129.84,88.04 130.56,87.32 130.56,83.46 ; 130.02,88.27 130,88.26 v1(127.97,88.26)
  Bottom Layer w1: v1(127.97,88.26) 127.97,89.17 130.2,91.4
FU_BP14+: length 12.6
  Top Layer w1: 115.22,83.39 114.91,83.71 114.91,88.13 ; v1(109,88.94) 109.6,88.35 114.04,88.35
  Bottom Layer w1: v1(109,88.94) 109.02,88.96 109.02,91.37
FU_BP15+: length 18.4
  Top Layer w1: 99.06,88.02 99.28,87.8 99.28,84.23 99.61,83.91 99.61,83.43 ; 98.88,88.38 96.9,88.38 v1(96.53,88.75)
  Bottom Layer w1: v1(96.53,88.75) 96.19,89.09 96.19,89.77 97.77,91.35 105.46,91.35
